# EasyEDA schematic 3.json
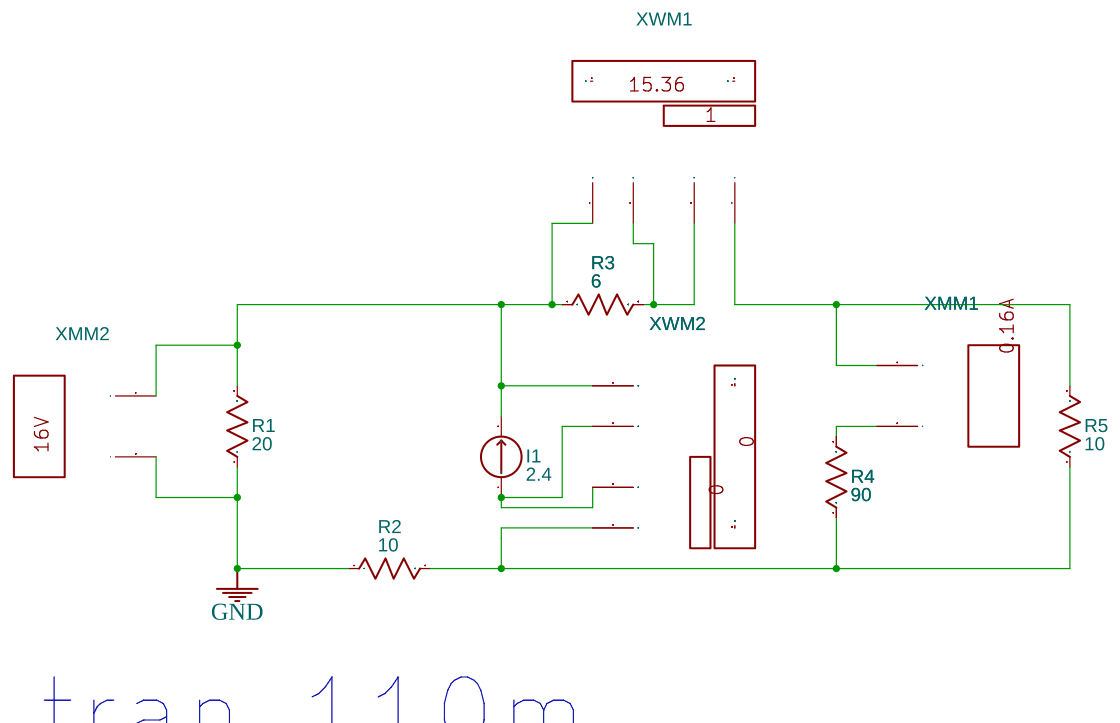
[diagram p0: schematic sheet]

## Parts
I1  2.4  [2P-5.08]
R1  20  [AXIAL-0.3]
R2  10  [AXIAL-0.3]
R3  6  [AXIAL-0.3]
R4  90  [AXIAL-0.3]
R5  10  [AXIAL-0.3]
XMM1  Multimeter
XMM2  Multimeter
XWM1  Wattmeter
XWM2  Wattmeter

## Library data of the parts
I1 = IDC: Contributor: EasyEDA; sim: true
R1-R5 = Resistor_US: Resistance: 1k; Contributor: EasyEDA; Supplier: YUJING
XMM1 = MULTIMETER: Supplier: LCSC; Multimeter Type: Amper; Power Type: AC; Voltmeter resistance: 10μ; Ammeter resistance: 1G; NameDisplay: 0; Contributor: EasyEDA; sim: true
XMM2 = MULTIMETER: Supplier: LCSC; Multimeter Type: Voltmeter; Power Type: AC; Voltmeter resistance: 10μ; Ammeter resistance: 1G; NameDisplay: 0; Contributor: EasyEDA; sim: true
XWM1 XWM2 = WATTMETER: Contributor: EasyEDA; NameDisplay: 0; sim: true

## Nets
GND: R1.1 R2.1 XMM2.2(I)
Net-(I1-1): I1.1 XWM2.2(V-) XWM2.3(I+)
Net-(I1-2): I1.2 R1.2 R3.1 XMM2.1(+) XWM1.1(V+) XWM2.1(V+)
Net-(R2-2): R2.2 R4.1 R5.1 XWM2.4(I-)
Net-(R3-2): R3.2 XWM1.2(V-) XWM1.3(I+)
Net-(R4-2): R4.2 XMM1.2(I)
Net-(R5-2): R5.2 XMM1.1(+) XWM1.4(I-)

Not connected (* = marked no-connect by the designer): XWM1 P PF; XWM2 P PF

## Notes on the sheet
- .tran 110m
